# EAGLE design Placa principal (EAGLE 7.6.0)
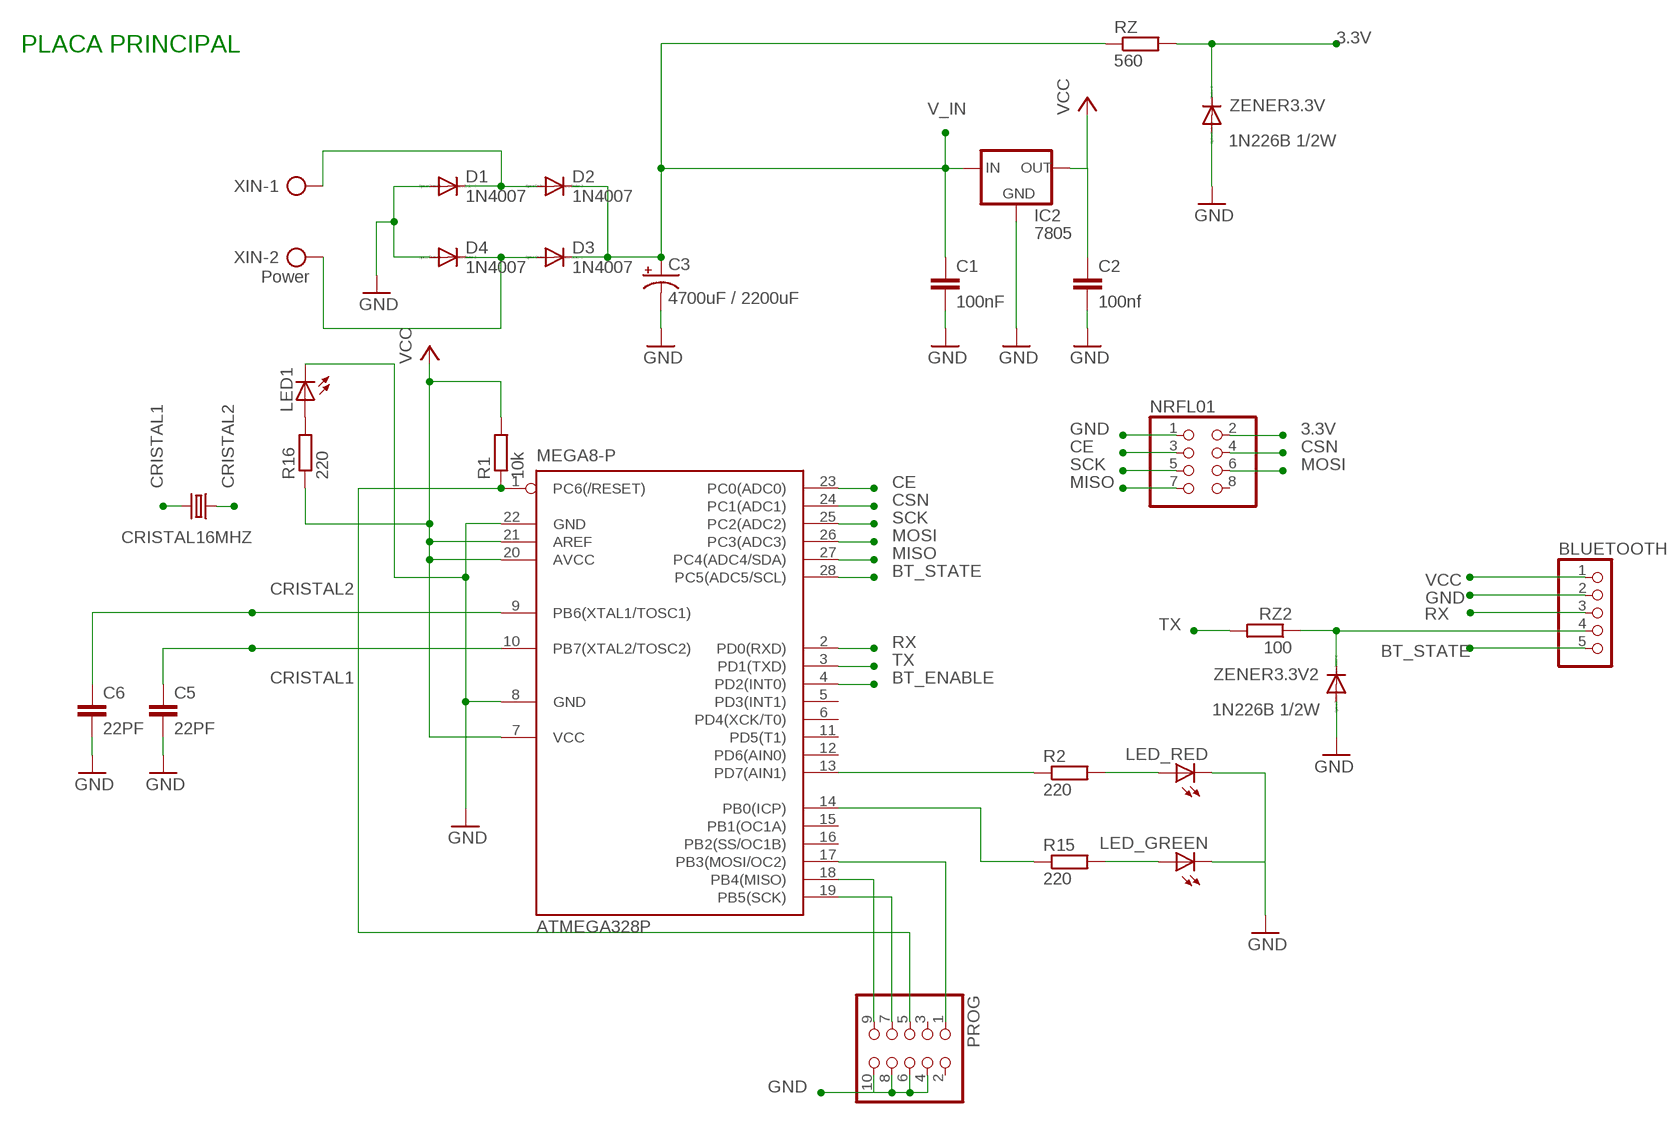
[diagram p0: schematic, sheet 1]

## Parts
ATMEGA328P  MEGA8-P  [DIL28-3]
BLUETOOTH  PINHD-1X5  [1X05]
C1  100nF  C-EU050-025X075  [C050-025X075]
C2  100nf  C-EU050-025X075  [C050-025X075]
C3  4700uF / 2200uF  CPOL-USE7.5-16  [E7,5-16]
C5  22PF  C-EU050-024X044  [C050-024X044]
C6  22PF  C-EU050-024X044  [C050-024X044]
CRISTAL16MHZ  CRYSTALHC49S  [HC49/S]
D1  1N4007  1N4004  [DO41-10]
D2  1N4007  1N4004  [DO41-10]
D3  1N4007  1N4004  [DO41-10]
D4  1N4007  1N4004  [DO41-10]
IC2  7805  78XXL  [78XXL]
LED1  LED5MM  [LED5MM]
LED_GREEN  LED5MM  [LED5MM]
LED_RED  LED5MM  [LED5MM]
NRFL01  PINHD-2X4  [2X04]
PROG  PINHD-2X5  [2X05]
R1  10k  R-EU_0207/10  [0207/10]
R2  220  R-EU_0207/10  [0207/10]
R15  220  R-EU_0207/10  [0207/10]
R16  220  R-EU_0309/10  [0309/10]
RZ  560  R-EU_0207/10  [0207/10]
RZ2  100  R-EU_0207/10  [0207/10]
XIN  Power  AK500/2  [AK500/2]
ZENER3.3V  1N226B 1/2W  1N4148DO35-10  [DO35-10]
ZENER3.3V2  1N226B 1/2W  1N4148DO35-10  [DO35-10]

## Nets
3.3V: NRFL01.2 RZ.2 ZENER3.3V.C
BT_ENABLE: ATMEGA328P.4(PD2(INT0))
BT_STATE: ATMEGA328P.28(PC5(ADC5/SCL)) BLUETOOTH.5
CE: ATMEGA328P.23(PC0(ADC0)) NRFL01.3
CRISTAL1: ATMEGA328P.10(PB7(XTAL2/TOSC2)) C5.1 CRISTAL16MHZ.2
CRISTAL2: ATMEGA328P.9(PB6(XTAL1/TOSC1)) C6.1 CRISTAL16MHZ.1
CSN: ATMEGA328P.24(PC1(ADC1)) NRFL01.4
GND: ATMEGA328P.8(GND) ATMEGA328P.22(GND) BLUETOOTH.2 C1.2 C2.2 C3.- C5.2 C6.2 D1.A D4.A IC2.GND LED1.K(C) LED_GREEN.K(C) LED_RED.K(C) NRFL01.1 PROG.4 PROG.6 PROG.8 PROG.10 ZENER3.3V2.A ZENER3.3V.A
MISO: ATMEGA328P.27(PC4(ADC4/SDA)) NRFL01.7
MOSI: ATMEGA328P.26(PC3(ADC3)) NRFL01.6
N$1: ATMEGA328P.1(PC6(/RESET)) PROG.5 R1.1
N$2: LED_RED.A R2.2
N$3: ATMEGA328P.14(PB0(ICP)) R15.1
N$4: ATMEGA328P.13(PD7(AIN1)) R2.1
N$16: ATMEGA328P.17(PB3(MOSI/OC2)) PROG.1
N$17: LED1.A R16.2
N$18: ATMEGA328P.19(PB5(SCK)) PROG.7
N$19: ATMEGA328P.18(PB4(MISO)) PROG.9
N$24: D1.C D2.A XIN.1
N$47: BLUETOOTH.4 RZ2.1 ZENER3.3V2.C
N$65: D3.A D4.C XIN.2
N$153: LED_GREEN.A R15.2
RX: ATMEGA328P.2(PD0(RXD)) BLUETOOTH.3
SCK: ATMEGA328P.25(PC2(ADC2)) NRFL01.5
TX: ATMEGA328P.3(PD1(TXD)) RZ2.2
V_IN: C1.1 C3.+ D2.C D3.C IC2.IN RZ.1
VCC: ATMEGA328P.7(VCC) ATMEGA328P.20(AVCC) ATMEGA328P.21(AREF) BLUETOOTH.1 C2.1 IC2.OUT R1.2 R16.1
Unconnected: ATMEGA328P.5(PD3(INT1)) ATMEGA328P.6(PD4(XCK/T0)) ATMEGA328P.11(PD5(T1)) ATMEGA328P.12(PD6(AIN0)) ATMEGA328P.15(PB1(OC1A)) ATMEGA328P.16(PB2(SS/OC1B)) NRFL01.8 PROG.2 PROG.3

## Notes on the sheet
- PLACA PRINCIPAL

## Library data of the parts
ATMEGA328P = atmel:MEGA8-P: MICROCONTROLLER 8 Kbytes FLASH, 1 kbytes SRAM, 512 bytes EEPROM, USART, 4-channel 10 bit ADC, 2-channel 8 bit ADC Pin compatible with Atmega48, ATMega88, ATMega168 Source: avr.lbr; OC_FARNELL: unknown; OC_NEWARK: unknown
BLUETOOTH = pinhead:PINHD-1X5: PIN HEADER
C1 C2 C5 C6 = rcl:C-EU: CAPACITOR, European symbol
C3 = rcl:CPOL-US: POLARIZED CAPACITOR, American symbol
CRISTAL16MHZ = crystal:CRYSTAL: CRYSTAL; OC_FARNELL: 1667008; OC_NEWARK: unknown
D1-D4 = diode:1N4004: DIODE general purpose rectifier, 1 A
IC2 = v-reg:78XXL: VOLTAGE REGULATOR
LED1 LED_GREEN LED_RED = led:LED: LED OSRAM: - CHIPLED LG R971, LG N971, LY N971, LG Q971, LY Q971, LO R971, LY R971 LH N974, LH R974 LS Q976, LO Q976, LY Q976 LO Q996 - Hyper CHIPLED LW Q18S LB Q993, LB Q99A, LB R99A - SideLED LS A670, LO A670, LY A670, LG A670, LP A670 LB A673, LV A673, LT A673, LW A673 LH A674 LY A675 LS A676, LA A676, LO A676, LY A676, LW A676 LS A679, LY A679, LG A679 - Hyper Micro SIDELED® LS Y876, LA Y876, LO Y876, LY Y876 LT Y87S - SmartLED LW L88C, LW L88S LB L89C, LB L89S, LG L890 LS L89K, LO L89K, LY L89K LS L896, LA L896, LO L896, LY L896 - TOPLED LS T670, LO T670, LY T670, LG T670, LP T670 LSG T670, LSP T670, LSY T670, LOP T670, LYG T670 LG T671, LOG T671, LSG T671 LB T673, LV T673, LT T673, LW T673 LH T674 LS T676, LA T676, LO T676, LY T676, LB T676, LH T676, LSB T676, LW T676 LB T67C, LV T67C, LT T67C, LS T67K, LO T67K, LY T67K, LW E67C LS E67B, LA E67B, LO E67B, LY E67B, LB E67C, LV E67C, LT E67C LW T67C LS T679, LY T679, LG T679 LS T770, LO T770, LY T770, LG T770, LP T770 LB T773, LV T773, LT T773, LW T773 LH T774 LS E675, LA E675, LY E675, LS T675 LS T776, LA T776, LO T776, LY T776, LB T776 LHGB T686 LT T68C, LB T68C - Hyper Mini TOPLED® LB M676 - Mini TOPLED Santana® LG M470 LS M47K, LO M47K, LY M47K Source: http://www.osram.convergy.de LUXEON: - LUMILED® LXK2-PW12-R00, LXK2-PW12-S00, LXK2-PW14-U00, LXK2-PW14-V00 LXK2-PM12-R00, LXK2-PM12-S00, LXK2-PM14-U00 LXK2-PE12-Q00, LXK2-PE12-R00, LXK2-PE12-S00, LXK2-PE14-T00, LXK2-PE14-U00 LXK2-PB12-K00, LXK2-PB12-L00, LXK2-PB12-M00, LXK2-PB14-N00, LXK2-PB14-P00, LXK2-PB14-Q00 LXK2-PR12-L00, LXK2-PR12-M00, LXK2-PR14-Q00, LXK2-PR14-R00 LXK2-PD12-Q00, LXK2-PD12-R00, LXK2-PD12-S00 LXK2-PH12-R00, LXK2-PH12-S00 LXK2-PL12-P00, LXK2-PL12-Q00, LXK2-PL12-R00 Source: www.luxeon.com KINGBRIGHT: KA-3528ASYC Source: www.kingbright.com
NRFL01 = pinhead:PINHD-2X4: PIN HEADER
PROG = pinhead:PINHD-2X5: PIN HEADER
R1 R2 R15 R16 RZ RZ2 = rcl:R-EU_: RESISTOR, European symbol
XIN = con-ptr500:AK500/2: CONNECTOR; OC_FARNELL: unknown; OC_NEWARK: unknown
ZENER3.3V ZENER3.3V2 = diode:1N4148: DIODE high speed (Philips)

## Board
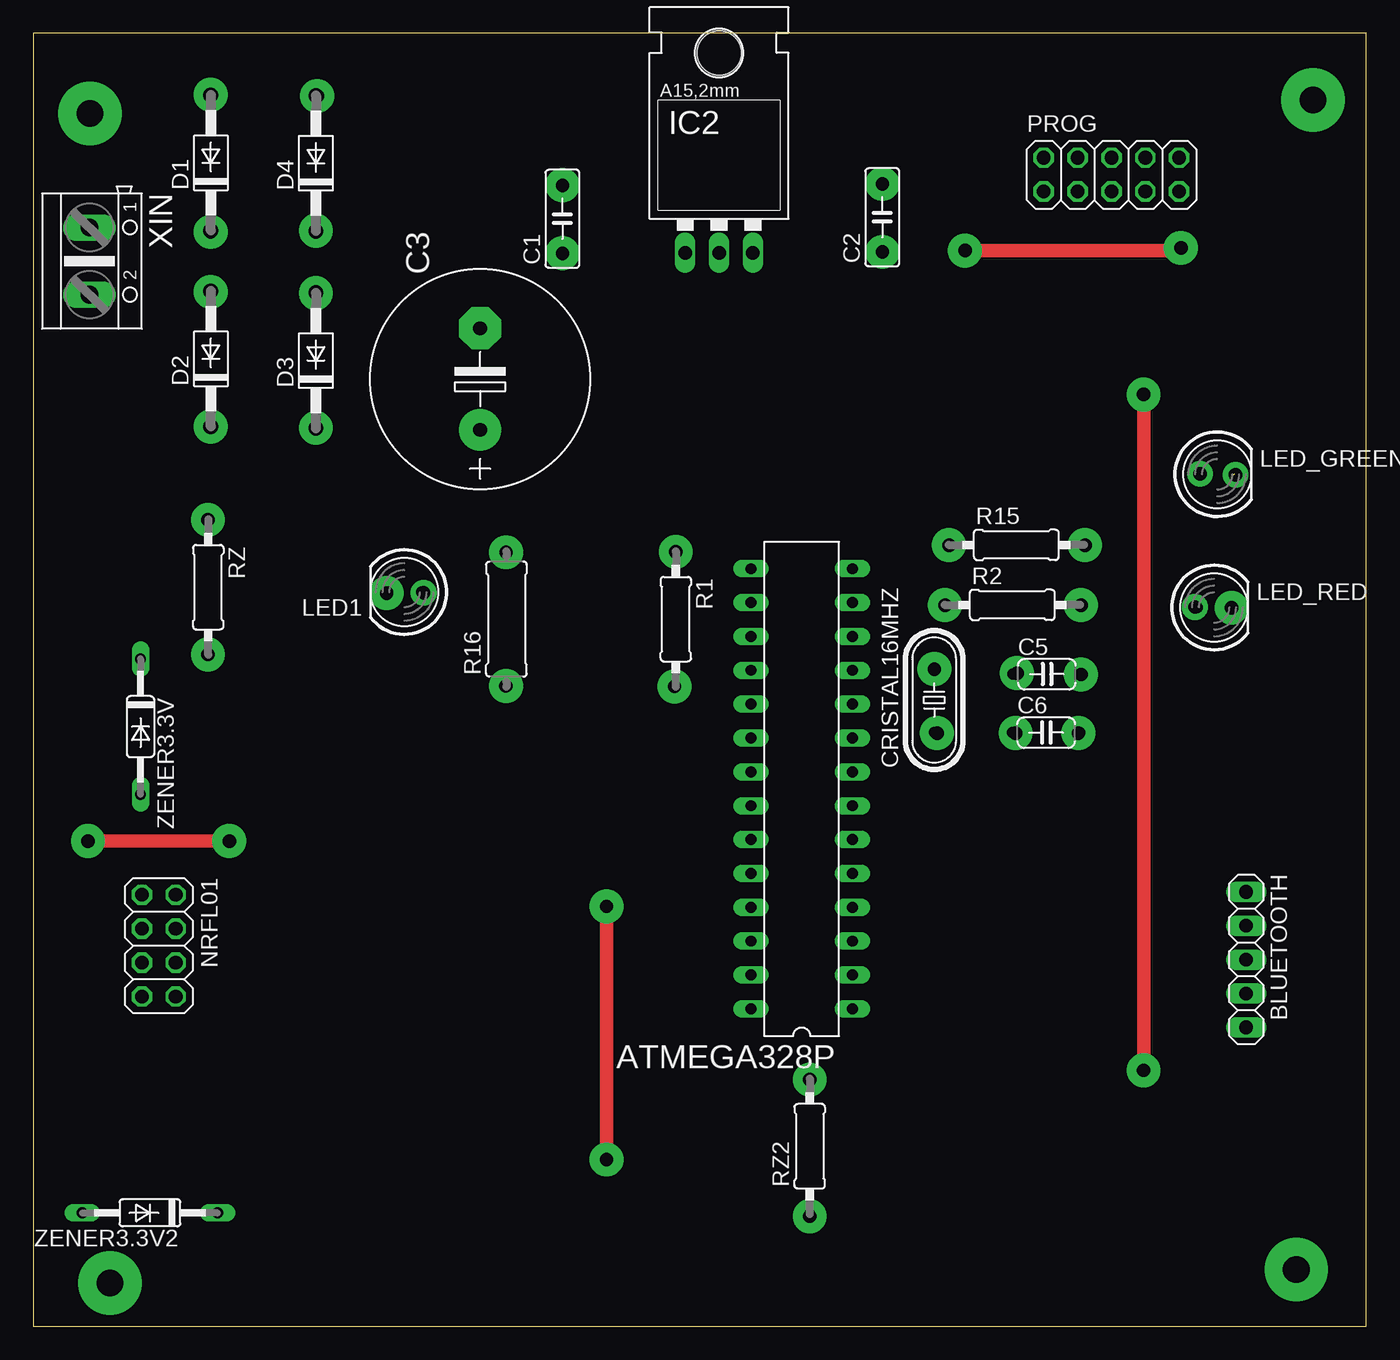
[diagram p1: board, top side]
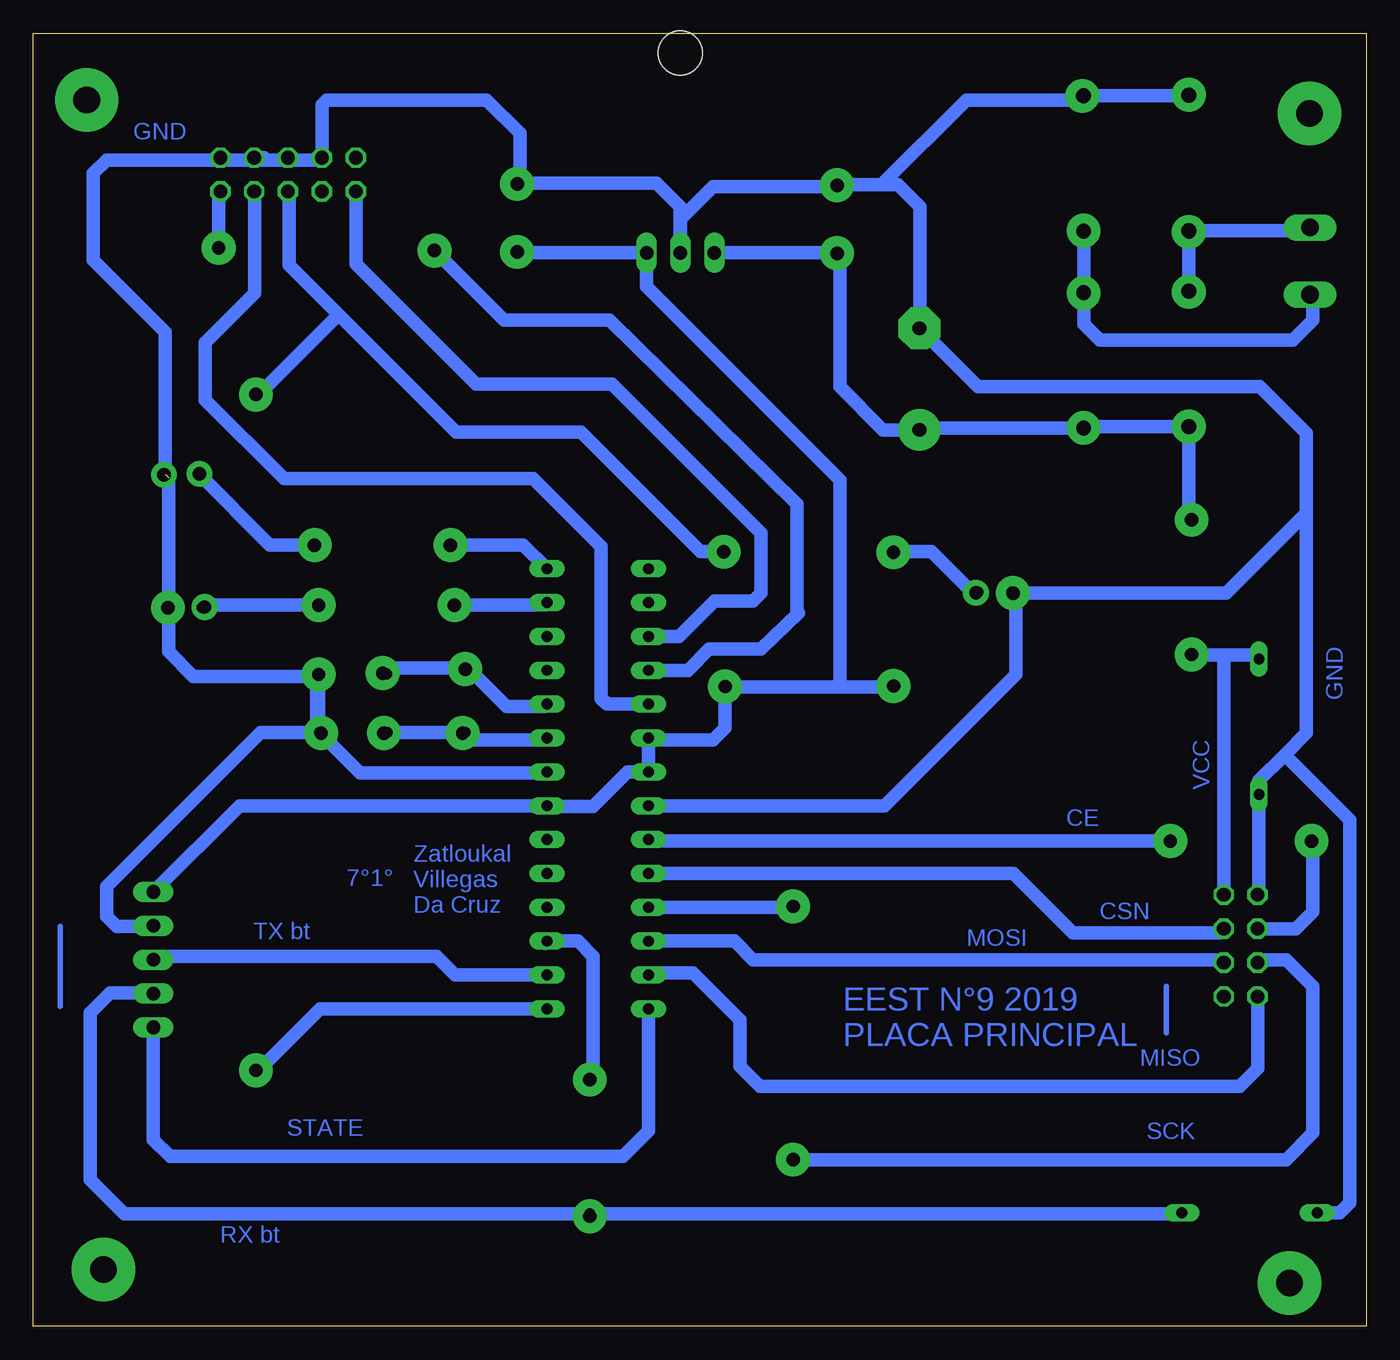
[diagram p2: board, bottom side, seen from below]

Size 100 x 97 mm. Coordinates in mm from the lower left corner, seen from the top.
Outline: 0,0 100,0 100,97 0,97 0,0
Copper layers (1*16): Top 0.035mm / dielectric 1.5mm / Bottom 0.035mm
Design rules "default": minimum track width 10mil, minimum drill 24mil, track to track 8mil, track to pad 8mil, pad to pad 8mil, via to via 8mil, smd to smd 8mil, copper to edge 40mil, drill to drill 8mil, minimum pad ring 10mil, minimum via ring 8mil, stop-mask expansion 4mil, vias tented up to drill 0mil, thermal gap 10mil

### Footprints (pad centres in the part's own frame; a part is rotated, then mirrored left to right if it is on the bottom)
DIL28-3 = drill 0.813 long: 1 -16.51,-3.81; 2 -13.97,-3.81; 3 -11.43,-3.81; 4 -8.89,-3.81; 5 -6.35,-3.81; 6 -3.81,-3.81; 7 -1.27,-3.81; 8 1.27,-3.81; 9 3.81,-3.81; 10 6.35,-3.81; 11 8.89,-3.81; 12 11.43,-3.81; 13 13.97,-3.81; 14 16.51,-3.81; 15 16.51,3.81; 16 13.97,3.81; 17 11.43,3.81; 18 8.89,3.81; 19 6.35,3.81; 20 3.81,3.81; 21 1.27,3.81; 22 -1.27,3.81; 23 -3.81,3.81; 24 -6.35,3.81; 25 -8.89,3.81; 26 -11.43,3.81; 27 -13.97,3.81; 28 -16.51,3.81
1X05 = drill 1.016 long: 1 -5.08,0; 2 -2.54,0; 3 0,0; 4 2.54,0; 5 5.08,0
C050-025X075 = drill 0.813 octagon: 1 -2.54,0; 2 2.54,0
E7,5-16 = drill 1.016 pad 3.15: + -3.81,0 | drill 1.016 pad 3.15 octagon: - 3.81,0
C050-024X044 = drill 0.813 octagon: 1 -2.54,0; 2 2.54,0
HC49/S = drill 0.813: 1 -2.413,0; 2 2.413,0
DO41-10 = drill 1.118: A 5.08,0; C -5.08,0
78XXL = drill 1.016 long: GND 0,-3.81; IN -2.54,-3.81; OUT 2.54,-3.81 | hole 3.302: 0,11.176
LED5MM = drill 0.813 octagon: A -1.27,0; K 1.27,0
2X04 = drill 1.016 octagon: 1 -3.81,-1.27; 2 -3.81,1.27; 3 -1.27,-1.27; 4 -1.27,1.27; 5 1.27,-1.27; 6 1.27,1.27; 7 3.81,-1.27; 8 3.81,1.27
2X05 = drill 1.016 octagon: 1 -5.08,-1.27; 2 -5.08,1.27; 3 -2.54,-1.27; 4 -2.54,1.27; 5 0,-1.27; 6 0,1.27; 7 2.54,-1.27; 8 2.54,1.27; 9 5.08,-1.27; 10 5.08,1.27
0207/10 = drill 0.813 octagon: 1 -5.08,0; 2 5.08,0
0309/10 = drill 0.813 octagon: 1 -5.08,0; 2 5.08,0
AK500/2 = drill 1.321 long: 1 -2.515,0; 2 2.515,0
DO35-10 = drill 0.813 long: A 5.08,0; C -5.08,0

### Placement (x,y rotation side)
ATMEGA328P  57.65,40.32 90 top
BLUETOOTH  91,27.5 270 top
C1  39.7,83.09 90 top
C2  63.7,83.2 90 top
C3  33.52,71.06 90 top
C5  76.04,48.92 0 top
C6  75.99,44.54 0 top
CRISTAL16MHZ  67.59,46.98 90 top
D1  13.32,87.28 90 top
D2  13.32,72.58 90 top
D3  21.2,72.45 90 top
D4  21.2,87.25 90 top
IC2  51.45,84.35 0 top
LED1  27.84,55.08 180 top
LED_GREEN  88.83,63.92 0 top
LED_RED  88.59,53.92 0 top
NRFL01  9.41,28.55 270 top
PROG  80.89,86.4 0 top
R1  48.2,53.05 270 top
R2  73.45,54.12 0 top
R15  73.75,58.62 0 top
R16  35.5,53.05 90 top
RZ  13.12,55.45 270 top
RZ2  58.25,13.5 90 top
XIN  4.21,79.91 270 top
ZENER3.3V  8.04,44.98 270 top
ZENER3.3V2  8.75,8.5 180 top

### Tracks (layer width: path | path; a pad name or v marks a point on that pad's centre or on a via)
3.3V
  Bottom 1.016: RZ.2 11,50.37 | 11,50.37 8.35,50.37 ZENER3.3V.C | NRFL01.2 10.68,50.05 11,50.37
BT_STATE
  Bottom 1.016: BLUETOOTH.5 91,14 89.75,12.75 55.75,12.75 53.84,14.66 ATMEGA328P.28
CE  (via drill 1 pad 2.54)
  Top 1.016: v4.1,36.4 v14.7,36.4
  Bottom 1.016: NRFL01.3 5.28,29.82 4,31.1 4,36.3 v4.1,36.4 | v14.7,36.4 53.73,36.4 ATMEGA328P.23
CRISTAL1
  Bottom 1.016: C5.1 73.03,49.39 CRISTAL16MHZ.2 67.39,49.39 64.5,46.5 61.63,46.5 ATMEGA328P.10
CRISTAL2
  Bottom 1.016: ATMEGA328P.9 61.59,44 67,44 67.57,44.57 CRISTAL16MHZ.1 67.62,44.54 C6.1
CSN
  Bottom 1.016: NRFL01.4 11,29.5 22,29.5 26.47,33.97 ATMEGA328P.24
GND  (1 unrouted)
  Bottom 1.016: 86.5,87.5 94.5,87.5 95.5,86.5 95.5,80 90.1,74.6 LED_GREEN.K | 86.5,87.5 82.5,87.5 | 82.5,87.5 80.5,87.5 | 80.5,87.5 78.52,87.5 PROG.4 78.35,91.65 78,92 66,92 63.5,89.5 63.5,85.94 C2.2 53.24,85.74 51.5,84 51.5,80.59 IC2.GND 51.45,83.05 49,85.5 39.83,85.5 C1.2 36.37,85.63 | PROG.10 86.33,87.67 86.5,87.5 | PROG.8 82.67,87.67 82.5,87.5 | PROG.6 80.67,87.67 80.5,87.5 | 36.37,85.63 30,92 21.53,92 D4.A 13.35,92.33 D1.A | 36.37,85.63 35.13,85.63 33.5,84 33.5,74.89 C3.- 29.15,70.5 8,70.5 4.5,67 4.5,61 | C5.2 78.58,44.59 C6.2 | C6.2 78.5,44.5 | NRFL01.1 8.04,32.46 ZENER3.3V.A 8.04,40.96 6.12,42.88 | 6.12,42.88 4.5,44.5 4.5,61 | ATMEGA328P.22 36.15,39.05 26.3,48.9 26.3,54.81 LED1.K 26.49,55 10.5,55 4.5,61 | ZENER3.3V2.A 2,8.5 1.25,9.25 1.25,38 6.12,42.88 | 89.86,63.68 LED_RED.K 89.86,50.61 88,48.75 79,48.75 78.75,49 78.75,45 78.5,44.75 78.5,44.5 | BLUETOOTH.2 91.04,30 93.75,30 94.5,30.75 94.5,33 82.96,44.54 C6.2 | ATMEGA328P.8 61.55,41.5 75.5,41.5 78.5,44.5
MISO
  Bottom 1.016: ATMEGA328P.27 53.69,26.5 50.5,26.5 47,23 47,19.5 45.5,18 9.5,18 8.14,19.36 NRFL01.7
MOSI
  Bottom 1.016: NRFL01.6 10.9,27.5 46,27.5 47.39,28.89 ATMEGA328P.26
N$1  (via drill 1 pad 2.54)
  Top 1.016: v83.3,19.2 v83.3,69.9
  Bottom 1.016: R1.1 49.93,58.13 58.9,67.1 68.3,67.1 77.1,75.9 | 77.1,75.9 80.8,79.6 80.8,85.04 PROG.5 | ATMEGA328P.1 78.49,23.81 83.1,19.2 v83.3,19.2 | v83.3,69.9 83.1,69.9 77.1,75.9
N$2
  Bottom 1.016: R2.2 87.12,54.12 LED_RED.A
N$3
  Bottom 1.016: R15.1 63.25,58.62 ATMEGA328P.14
N$4
  Bottom 1.016: R2.1 61.63,54.12 ATMEGA328P.13
N$5  (via drill 1 pad 2.54)
  other vias: 48.1,48
N$6  (via drill 1 pad 2.54)
  other vias: 35.46,48.04
N$7  (via drill 1 pad 2.54)
  other vias: 35.46,58.06
N$8  (via drill 1 pad 2.54)
  other vias: 26.5,55
N$9  (via drill 1 pad 1.93)
  other vias: 87.54,63.95
N$10  (via drill 1 pad 2.54)
  other vias: 89.9,53.9
N$11  (via drill 1 pad 2.54)
  other vias: 48.2,58.1
N$12  (via drill 1 pad 2.54)
  other vias: 13.1,60.5
N$13  (via drill 1 pad 2.54)
  other vias: 13.1,50.4
N$14  (via drill 1 pad 2.54)
  other vias: 78.9,58.6
N$15  (via drill 1 pad 2.54)
  other vias: 78.6,54.1
N$16
  Bottom 1.016: ATMEGA328P.17 51.55,51.75 48.9,54.4 46,54.4 45.4,55 45.4,59.5 56.6,70.7 60.1,70.7 60.25,70.7 66.8,70.7 75.8,79.7 PROG.1
N$17
  Bottom 1.016: R16.2 32.63,58.13 29.5,55 29.19,55 LED1.A
N$18
  Bottom 1.016: 83.6,84.96 PROG.7 83.4,85.1 83.4,77.5 87.1,73.8 87.1,69.5 81.2,63.6 62.5,63.6 57.4,58.5 57.4,47.1 56.97,46.67 ATMEGA328P.19
N$19  (via drill 1 pad 2.54)
  Top 1.016: v69.9,80.7 85.9,80.7 v86.1,80.9
  Bottom 1.016: ATMEGA328P.18 50.89,49.21 49.3,50.8 45.4,50.8 42.6,53.5 42.69,53.66 42.69,61.68 56.76,75.5 64.7,75.5 v69.9,80.7 | v86.1,80.9 86.1,85 PROG.9
N$20  (via drill 1 pad 2.54)
  other vias: 68.4,54.1
N$21  (via drill 1 pad 2.54)
  other vias: 68.7,58.6
N$22  (via drill 1 pad 2.54)
  other vias: 63.7,80.6
N$23  (via drill 1 pad 2.54)
  other vias: 63.7,85.7
N$24
  Bottom 1.016: XIN.1 4.43,82.2 D1.C D2.A
N$25  (via drill 1 pad 2.54)
  other vias: 39.7,85.6
N$26  (via drill 1 pad 2.54)
  other vias: 39.7,80.5
N$27  (via drill 1 pad 2.54)
  other vias: 13.3,82.1
N$28  (via drill 1 pad 2.54)
  other vias: 21.2,82.2
N$29  (via drill 1 pad 2.54)
  other vias: 21.3,92.3
N$30  (via drill 1 pad 2.54)
  other vias: 13.3,92.4
N$31  (via drill 1 pad 2.54)
  other vias: 13.3,77.6
N$32  (via drill 1 pad 2.54)
  other vias: 21.2,67.4
N$33  (via drill 1 pad 2.54)
  other vias: 13.3,67.5
N$34  (via drill 1 pad 2.54)
  other vias: 78.4,44.5
N$35  (via drill 1 pad 2.54)
  other vias: 78.6,48.9
N$36  (via drill 1 pad 2.54)
  other vias: 73.8,49
N$37  (via drill 1 pad 2.54)
  other vias: 73.7,44.5
N$38  (via drill 1 pad 2.54)
  other vias: 67.8,44.5
N$39  (via drill 1 pad 2.54)
  other vias: 67.6,49.3
N$40  (via drill 1 pad 1.93)
  other vias: 90.2,63.87
N$41  (via drill 1 pad 1.93)
  other vias: 87.15,53.95
N$42  (via drill 1 pad 1.93)
  other vias: 29.28,55.03
N$43  (via drill 2 pad 4.75)
  other vias: 4.25,91
N$44  (via drill 2 pad 4.75)
  other vias: 96,92
N$45  (via drill 2 pad 4.75)
  other vias: 94.75,4.25
N$46  (via drill 2 pad 4.75)
  other vias: 5.75,3.25
N$47
  Bottom 1.016: ZENER3.3V2.C 13.91,8.42 RZ2.1 93.17,8.42 95.75,11 95.75,23.5 94.25,25 91.04,25 BLUETOOTH.4
N$48  (via drill 1 pad 2.54)
  other vias: 58.25,8.25
N$49  (via drill 1 pad 2.54)
  other vias: 58.25,18.5
N$50
  Bottom 0.406: 15,25.5 15,22
N$51
  Bottom 0.406: 98,30 98,24
N$65  (via drill 1 pad 2.54)
  Bottom 1.016: D4.C D3.A v21.2,77.5 21.2,75.2 20,74 5.5,74 4,75.5 4,77.19 XIN.2
N$153
  Bottom 1.016: R15.2 82.26,58.62 LED_GREEN.A
RX
  Bottom 1.016: BLUETOOTH.3 90.75,27.75 69.75,27.75 68.35,26.35 ATMEGA328P.2
SCK  (via drill 1 pad 2.54)
  Top 1.016: v43,12.5 v43,31.5
  Bottom 1.016: NRFL01.5 7.92,27.5 6,27.5 4,25.5 4,14.5 6,12.5 v43,12.5 | v43,31.5 43.07,31.43 ATMEGA328P.25
TX
  Bottom 1.016: 61.62,28.73 ATMEGA328P.3 59.14,28.89 58,27.75 58,18.83 RZ2.2
V_IN
  Bottom 1.016: IC2.IN C1.1 39.5,80.35 39.5,70.5 36.25,67.25 C3.+ 33.4,67.37 D3.C 21.07,67.5 D2.C 13.32,60.73 RZ.1
VCC
  Bottom 1.016: C2.1 63.58,80.54 IC2.OUT 54,78 39.5,63.5 39.5,47.97 | R16.1 39.5,47.97 | 39.5,47.97 R1.2 48.1,47.87 48.1,44.9 49,44 53.71,44 ATMEGA328P.20 ATMEGA328P.21 55.41,41.59 58,39 61.41,39 ATMEGA328P.7 84.53,39.05 BLUETOOTH.1

### Text on the board
Bottom: GND | GND | VCC | CE | 7°1° | Zatloukal / Villegas / Da Cruz | CSN | TX bt | MOSI | EEST N°9 2019 / PLACA PRINCIPAL | MISO | SCK | STATE | RX bt